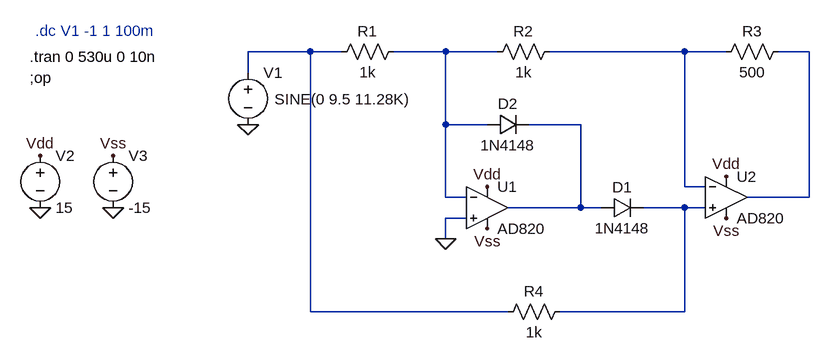
[diagram p0: schematic Etaj 4.asc]
Etaj 4.asc, the LTspice schematic file:
Version 4
SHEET 1 880 680
WIRE -240 -48 -336 -48
WIRE -192 -48 -240 -48
WIRE -32 -48 -112 -48
WIRE 48 -48 -32 -48
WIRE 336 -48 128 -48
WIRE 400 -48 336 -48
WIRE 528 -48 480 -48
WIRE -336 -16 -336 -48
WIRE -32 64 -32 -48
WIRE 32 64 -32 64
WIRE 176 64 96 64
WIRE 336 160 336 -48
WIRE 368 160 336 160
WIRE -32 176 -32 64
WIRE 0 176 -32 176
WIRE 528 176 528 -48
WIRE 528 176 432 176
WIRE 176 192 176 64
WIRE 176 192 64 192
WIRE 208 192 176 192
WIRE 336 192 272 192
WIRE 368 192 336 192
WIRE 0 208 -32 208
WIRE -32 240 -32 208
WIRE -240 352 -240 -48
WIRE 64 352 -240 352
WIRE 336 352 336 192
WIRE 336 352 144 352
FLAG -32 240 0
FLAG -336 64 0
FLAG -656 192 0
FLAG -544 192 0
FLAG -656 112 Vdd
FLAG -544 112 Vss
FLAG 400 208 Vss
FLAG 32 224 Vss
FLAG 32 160 Vdd
FLAG 400 144 Vdd
DATAFLAG -304 -48 ""
SYMBOL OpAmps\\AD820 32 128 R0
SYMATTR InstName U1
SYMBOL OpAmps\\AD820 400 112 R0
SYMATTR InstName U2
SYMBOL diode 208 208 R270
WINDOW 0 32 32 VTop 2
WINDOW 3 0 32 VBottom 2
SYMATTR InstName D1
SYMATTR Value 1N4148
SYMBOL diode 32 80 R270
WINDOW 0 32 32 VTop 2
WINDOW 3 0 32 VBottom 2
SYMATTR InstName D2
SYMATTR Value 1N4148
SYMBOL res 144 -64 R90
WINDOW 0 0 56 VBottom 2
WINDOW 3 32 56 VTop 2
SYMATTR InstName R2
SYMATTR Value 1k
SYMBOL res 496 -64 R90
WINDOW 0 0 56 VBottom 2
WINDOW 3 32 56 VTop 2
SYMATTR InstName R3
SYMATTR Value 500
SYMBOL res -96 -64 R90
WINDOW 0 0 56 VBottom 2
WINDOW 3 32 56 VTop 2
SYMATTR InstName R1
SYMATTR Value 1k
SYMBOL res 160 336 R90
WINDOW 0 0 56 VBottom 2
WINDOW 3 32 56 VTop 2
SYMATTR InstName R4
SYMATTR Value 1k
SYMBOL voltage -336 -32 R0
WINDOW 123 24 124 Left 2
WINDOW 39 0 0 Left 0
WINDOW 3 41 57 Left 2
SYMATTR InstName V1
SYMATTR Value SINE(0 9.5 11.28K)
SYMBOL voltage -656 96 R0
WINDOW 123 0 0 Left 0
WINDOW 39 0 0 Left 0
SYMATTR InstName V2
SYMATTR Value 15
SYMBOL voltage -544 96 R0
WINDOW 123 0 0 Left 0
WINDOW 39 0 0 Left 0
SYMATTR InstName V3
SYMATTR Value -15
TEXT -672 -40 Left 2 !.tran 0 530u 0 10n
TEXT -672 -8 Left 2 !;op
TEXT -664 -80 Left 2 ;.dc V1 -1 1 100m

The netlist it stands for:
* Etaj 4.asc
XU1 0 N002 Vdd Vss N005 AD820  ; pins In+ In- V+ V- OUT
XU2 N006 N003 Vdd Vss N004 AD820  ; pins In+ In- V+ V- OUT
D1 N005 N006 1N4148
D2 N002 N005 1N4148
R2 N003 N002 1k
R3 N004 N003 500
R1 N002 N001 1k
R4 N006 N001 1k
V1 N001 0 SINE(0 9.5 11.28K)
V2 Vdd 0 15
V3 Vss 0 -15
.model D D
.lib standard.dio
.tran 0 530u 0 10n
;op
* .dc V1 -1 1 100m
.backanno
.end